# EAGLE schematic lamp (EAGLE 9.6.2)
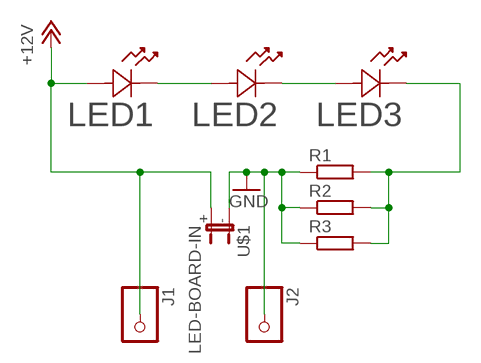
[diagram p0: schematic, sheet 1]

## Parts
J1  LARGE-SOLDERPAD  [LARGE-SOLDERPAD]
J2  LARGE-SOLDERPAD  [LARGE-SOLDERPAD]
LED1  LED-2835LED_J2835_CRW-M  [LED_J2835_CRW-M]
LED2  LED-2835LED_J2835_CRW-M  [LED_J2835_CRW-M]
LED3  LED-2835LED_J2835_CRW-M  [LED_J2835_CRW-M]
R1  R-EU_R0805  [R0805]
R2  R-EU_R0805  [R0805]
R3  R-EU_R0805  [R0805]
U$1  LED-BOARD-IN  [LED-BOARD-IN]

## Nets
+12V: J1.P$1 LED1.2 U$1.+
GND: J2.P$1 R1.1 R2.1 R3.1 U$1.-
N$1: LED1.1 LED2.2
N$2: LED2.1 LED3.2
N$4: LED3.1 R1.2 R2.2 R3.2

## Library data of the parts
J1 J2 = eagleparts:LARGE-SOLDERPAD
LED1-LED3 = eagleparts:LED-2835; COPYRIGHT: Copyright (C) 2024 Ultra Librarian. All rights reserved.; MANUFACTURER_PART_NUMBER: JB2835AWT-W-U30GA0000-N0000001; MFR_NAME: Wolfspeed
R1-R3 = rcl:R-EU_: RESISTOR, European symbol; SPICEPREFIX: R
U$1 = eagleparts:LED-BOARD-IN